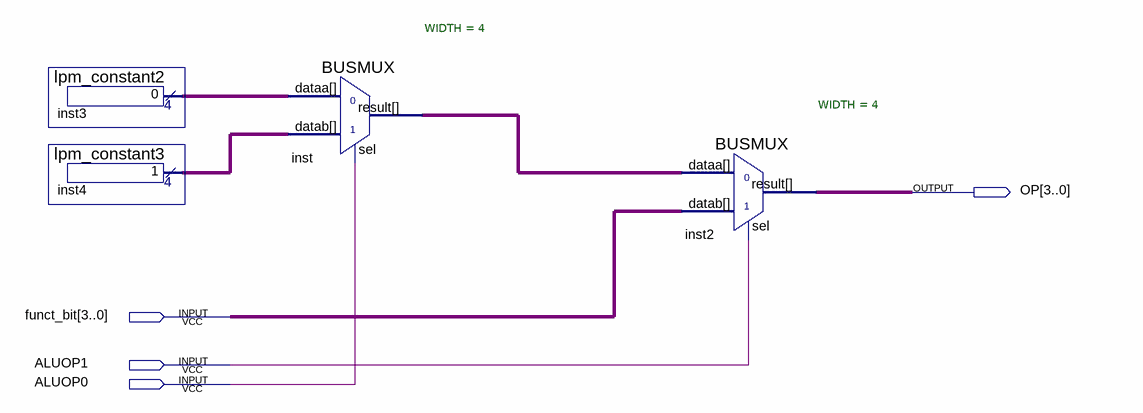
[diagram p0: schematic sheet]
// Quartus schematic Alucontrol.bdf as structural Verilog: 4 symbols, 4 pins
module Alucontrol (
  input  [3:0] funct_bit,
  input  ALUOP1,
  input  ALUOP0,
  output [3:0] OP
);

  wire [3:0] inst3_result, inst4_result, inst_result;

  lpm_constant2 inst3 (.result(inst3_result));
  lpm_constant3 inst4 (.result(inst4_result));
  BUSMUX #(.WIDTH(4)) inst (.datab(inst4_result), .sel(ALUOP0), .dataa(inst3_result), .result(inst_result));
  BUSMUX #(.WIDTH(4)) inst2 (.datab(funct_bit), .sel(ALUOP1), .dataa(inst_result), .result(OP));
endmodule
